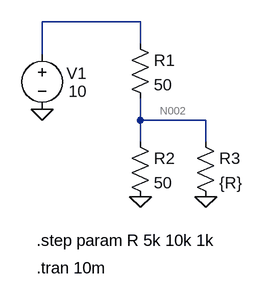
[diagram p0: schematic Resistor_Variable.asc]
Resistor_Variable.asc, the LTspice schematic file:
Version 4.1
SHEET 1 880 680
WIRE 80 32 -64 32
WIRE 80 64 80 32
WIRE -64 80 -64 32
WIRE 80 176 80 144
WIRE 176 176 80 176
WIRE 80 208 80 176
WIRE 176 208 176 176
FLAG 80 288 0
FLAG 176 288 0
FLAG -64 160 0
SYMBOL res 64 48 R0
SYMATTR InstName R1
SYMATTR Value 50
SYMBOL res 64 192 R0
SYMATTR InstName R2
SYMATTR Value 50
SYMBOL res 160 192 R0
SYMATTR InstName R3
SYMATTR Value {R}
SYMBOL voltage -64 64 R0
WINDOW 123 0 0 Left 2
WINDOW 39 0 0 Left 2
WINDOW 0 36 43 Left 2
WINDOW 3 39 70 Left 2
SYMATTR InstName V1
SYMATTR Value 10
TEXT -72 352 Left 2 !.step param R 5k 10k 1k
TEXT -72 392 Left 2 !.tran 10m

The netlist it stands for:
* Resistor_Variable.asc
R1 N001 N002 50
R2 N002 0 50
R3 N002 0 {R}
V1 N001 0 10
.step param R 5k 10k 1k
.tran 10m
.backanno
.end

* Results of the author's LTspice run, read from the files saved beside the schematic
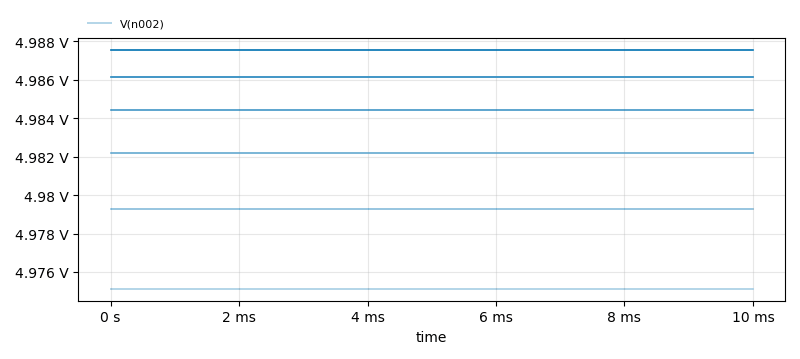
[diagram p1: Transient Analysis of Resistor_Variable.asc, plotted from the saved traces]
* Transient Analysis, 6 runs:
*   V(n002) [run 1]: min 4.975 V, max 4.975 V, average 4.975 V, rms 4.975 V, last 4.975 V
*   V(n002) [run 2]: min 4.979 V, max 4.979 V, average 4.979 V, rms 4.979 V, last 4.979 V
*   V(n002) [run 3]: min 4.982 V, max 4.982 V, average 4.982 V, rms 4.982 V, last 4.982 V
*   V(n002) [run 4]: min 4.984 V, max 4.984 V, average 4.984 V, rms 4.984 V, last 4.984 V
*   V(n002) [run 5]: min 4.986 V, max 4.986 V, average 4.986 V, rms 4.986 V, last 4.986 V
*   V(n002) [run 6]: min 4.988 V, max 4.988 V, average 4.988 V, rms 4.988 V, last 4.988 V